# EAGLE design Periscope (EAGLE 7.5.0)
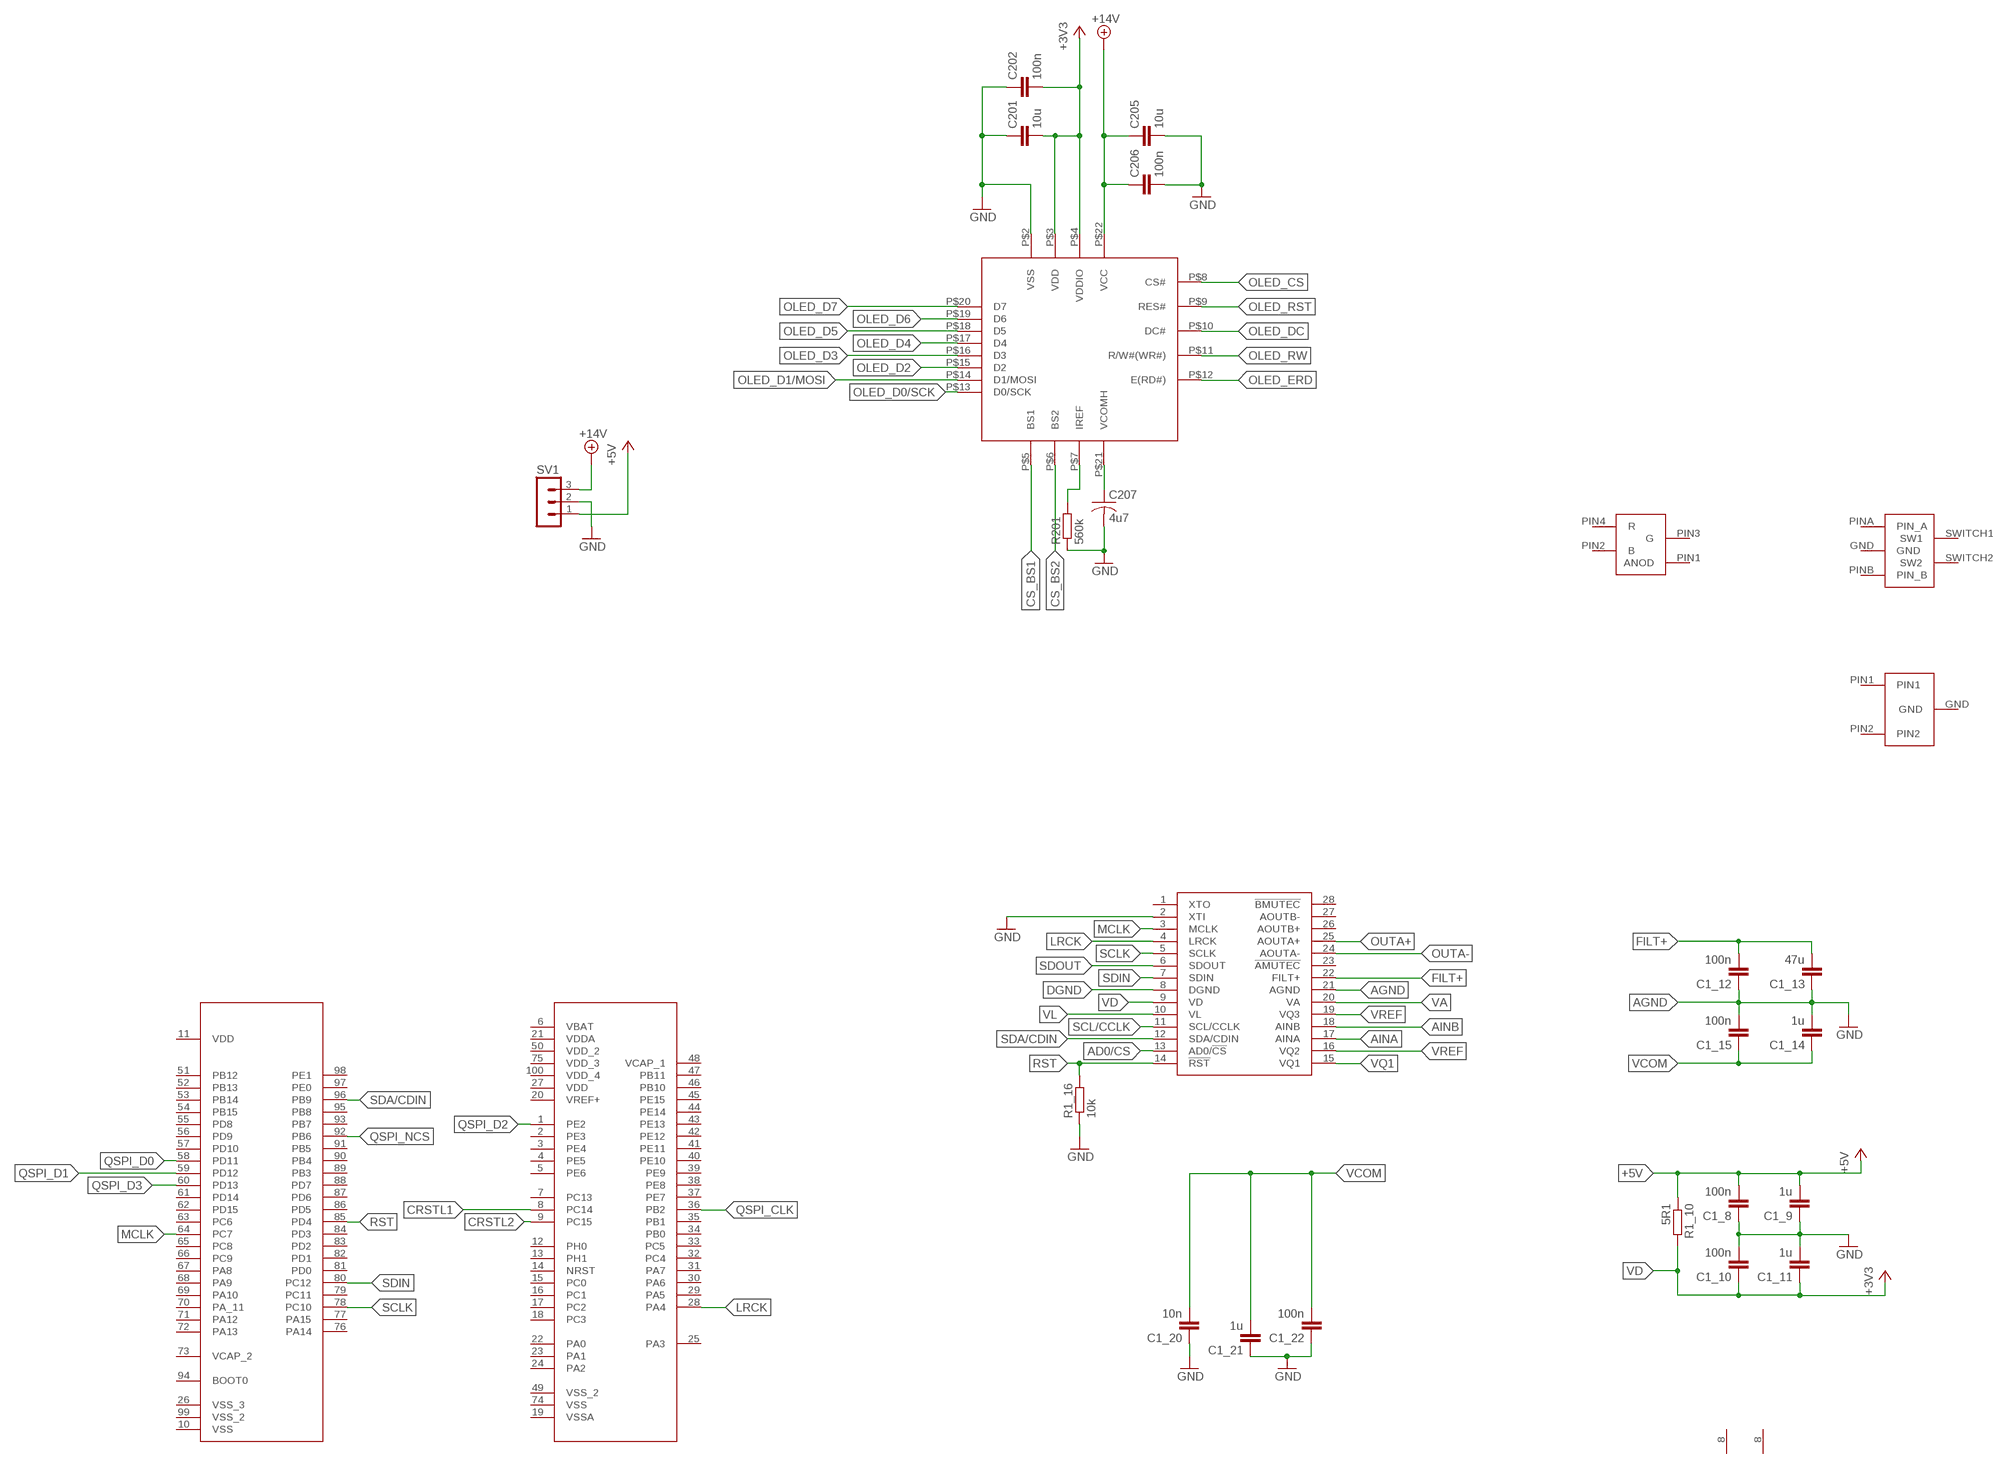
[diagram p0: schematic, sheet 1, part 1 of 3]
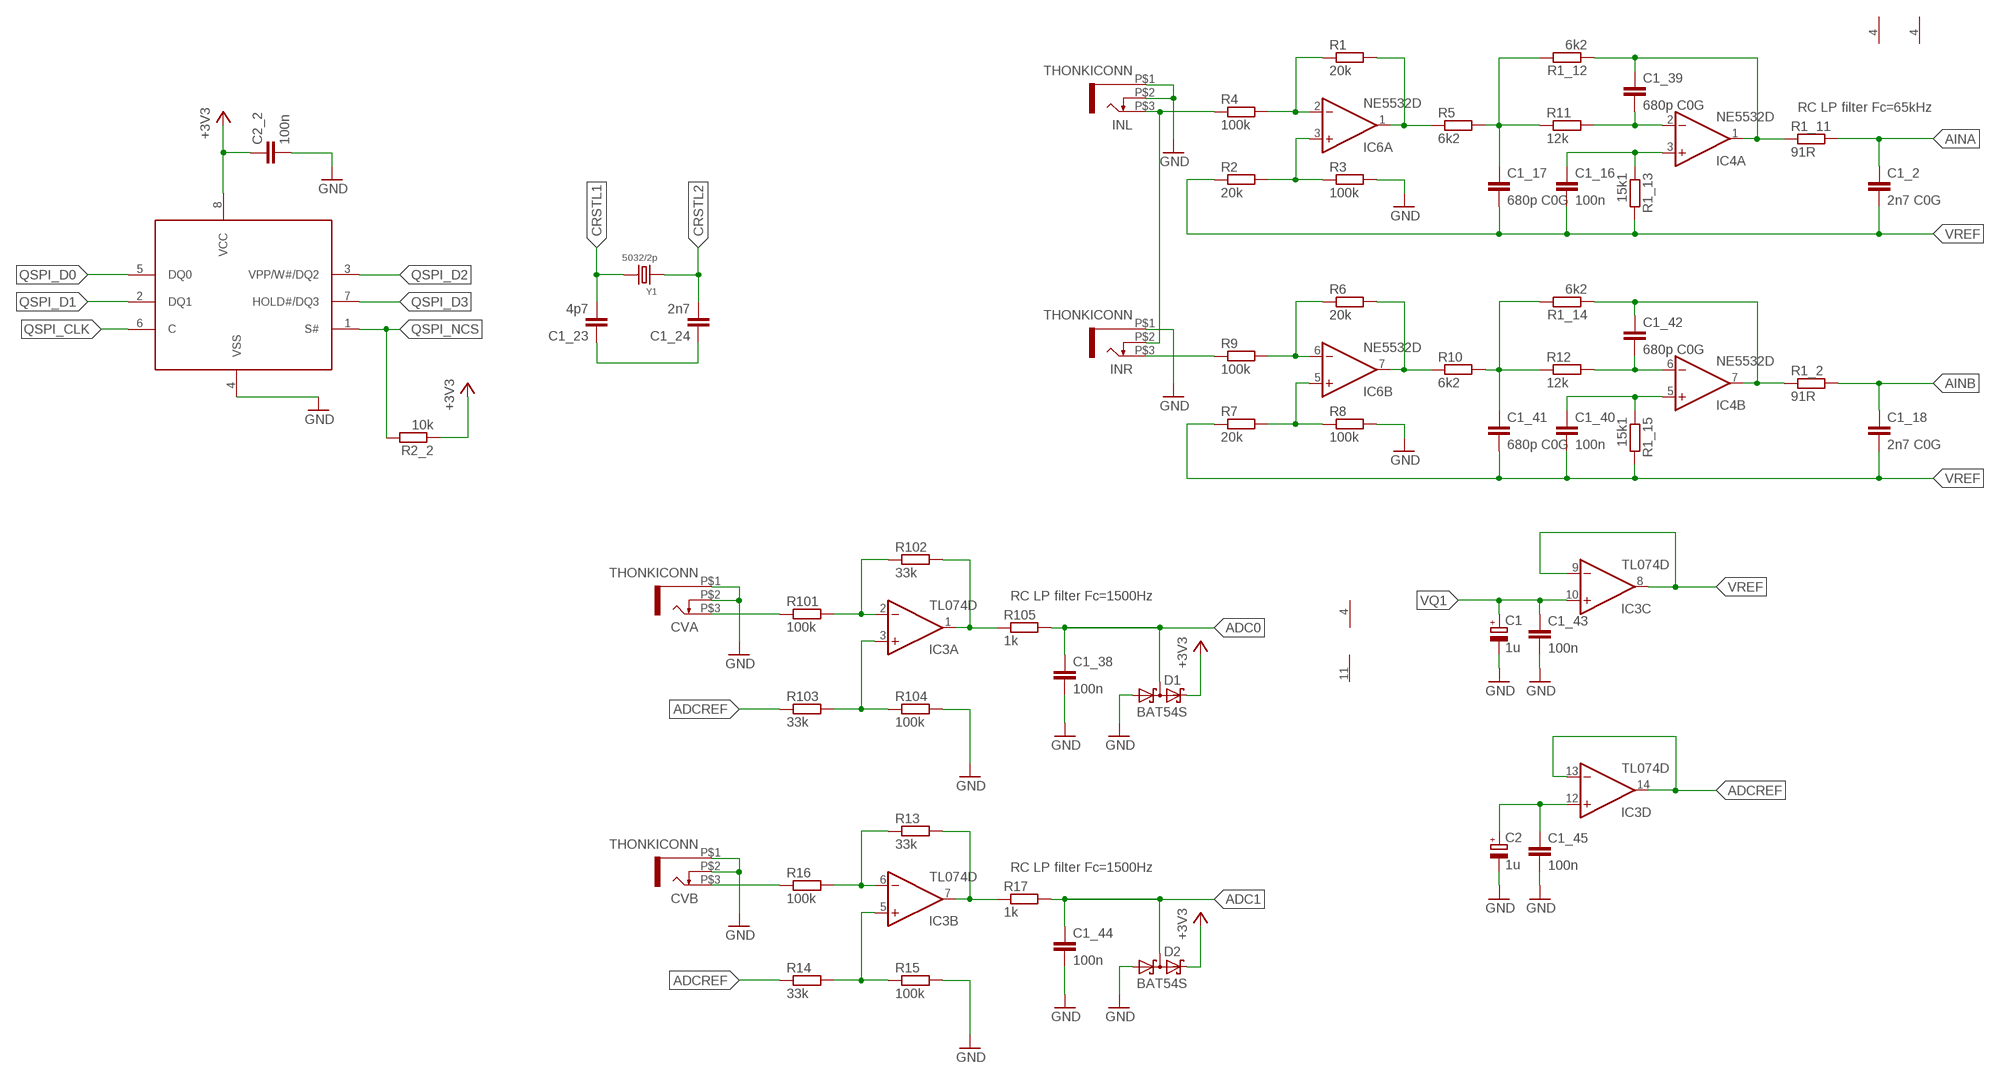
[diagram p1: schematic, sheet 1, part 2 of 3]
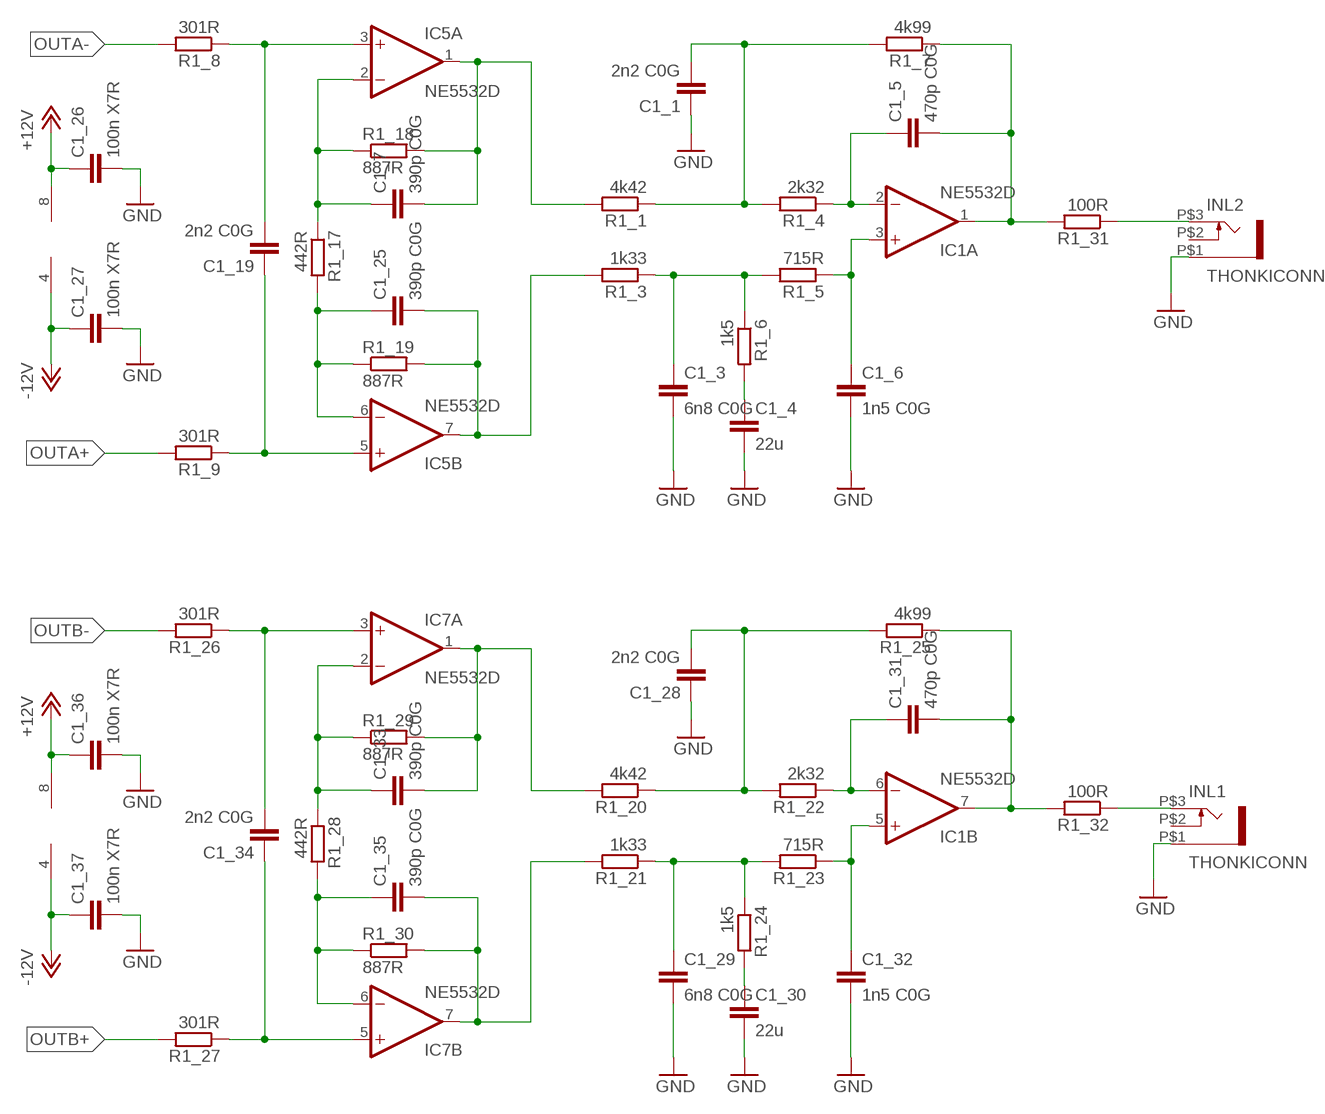
[diagram p2: schematic, sheet 1, part 3 of 3]

## Parts
C1  1u  CPOL-EU153CLV-0505  [153CLV-0505]
C1_1  2n2 C0G  C-EUC0603  [C0603]
C1_2  2n7 C0G  C-EUC0603  [C0603]
C1_3  6n8 C0G  C-EUC0603  [C0603]
C1_4  22u  C-EUC0603  [C0603]
C1_5  470p C0G  C-EUC0603  [C0603]
C1_6  1n5 C0G  C-EUC0603  [C0603]
C1_7  390p C0G  C-EUC0603  [C0603]
C1_8  100n  C-EUC0603  [C0603]
C1_9  1u  C-EUC0603  [C0603]
C1_10  100n  C-EUC0603  [C0603]
C1_11  1u  C-EUC0603  [C0603]
C1_12  100n  C-EUC0603  [C0603]
C1_13  47u  C-EUC0603  [C0603]
C1_14  1u  C-EUC0603  [C0603]
C1_15  100n  C-EUC0603  [C0603]
C1_16  100n  C-EUC0603  [C0603]
C1_17  680p C0G  C-EUC0603  [C0603]
C1_18  2n7 C0G  C-EUC0603  [C0603]
C1_19  2n2 C0G  C-EUC0603  [C0603]
C1_20  10n  C-EUC0603  [C0603]
C1_21  1u  C-EUC0603  [C0603]
C1_22  100n  C-EUC0603  [C0603]
C1_23  4p7  C-EUC0603  [C0603]
C1_24  2n7  C-EUC0603  [C0603]
C1_25  390p C0G  C-EUC0603  [C0603]
C1_26  100n X7R  C-EUC0603  [C0603]
C1_27  100n X7R  C-EUC0603  [C0603]
C1_28  2n2 C0G  C-EUC0603  [C0603]
C1_29  6n8 C0G  C-EUC0603  [C0603]
C1_30  22u  C-EUC0603  [C0603]
C1_31  470p C0G  C-EUC0603  [C0603]
C1_32  1n5 C0G  C-EUC0603  [C0603]
C1_33  390p C0G  C-EUC0603  [C0603]
C1_34  2n2 C0G  C-EUC0603  [C0603]
C1_35  390p C0G  C-EUC0603  [C0603]
C1_36  100n X7R  C-EUC0603  [C0603]
C1_37  100n X7R  C-EUC0603  [C0603]
C1_38  100n  C-EUC0603  [C0603]
C1_39  680p C0G  C-EUC0603  [C0603]
C1_40  100n  C-EUC0603  [C0603]
C1_41  680p C0G  C-EUC0603  [C0603]
C1_42  680p C0G  C-EUC0603  [C0603]
C1_43  100n  C-EUC0603  [C0603]
C1_44  100n  C-EUC0603  [C0603]
C1_45  100n  C-EUC0603  [C0603]
C2  1u  CPOL-EU153CLV-0505  [153CLV-0505]
C2_2  100n  C-EUC0603  [C0603]
C201  10u  C-EUC0603  [C0603]
C202  100n  C-EUC0603  [C0603]
C205  10u  C-EUC0603  [C0603]
C206  100n  C-EUC0603  [C0603]
C207  4u7  C-USC0603  [C0603]
CVA  THONKICONN  [THONKICONN]
CVB  THONKICONN  [THONKICONN]
D1  BAT54S  [SOT23]
D2  BAT54S  [SOT23]
IC1  NE5532D  [SO08]
IC3  TL074D  [SO14]
IC4  NE5532D  [SO08]
IC5  NE5532D  [SO08]
IC6  NE5532D  [SO08]
IC7  NE5532D  [SO08]
INL  THONKICONN  [THONKICONN]
INL1  THONKICONN  [THONKICONN]
INL2  THONKICONN  [THONKICONN]
INR  THONKICONN  [THONKICONN]
R1  20k  R-EU_R0603  [R0603]
R1_1  4k42  R-EU_R0603  [R0603]
R1_2  91R  R-EU_R0603  [R0603]
R1_3  1k33  R-EU_R0603  [R0603]
R1_4  2k32  R-EU_R0603  [R0603]
R1_5  715R  R-EU_R0603  [R0603]
R1_6  1k5  R-EU_R0603  [R0603]
R1_7  4k99  R-EU_R0603  [R0603]
R1_8  301R  R-EU_R0603  [R0603]
R1_9  301R  R-EU_R0603  [R0603]
R1_10  5R1  R-EU_R0603  [R0603]
R1_11  91R  R-EU_R0603  [R0603]
R1_12  6k2  R-EU_R0603  [R0603]
R1_13  15k1  R-EU_R0603  [R0603]
R1_14  6k2  R-EU_R0603  [R0603]
R1_15  15k1  R-EU_R0603  [R0603]
R1_16  10k  R-EU_R0603  [R0603]
R1_17  442R  R-EU_R0603  [R0603]
R1_18  887R  R-EU_R0603  [R0603]
R1_19  887R  R-EU_R0603  [R0603]
R1_20  4k42  R-EU_R0603  [R0603]
R1_21  1k33  R-EU_R0603  [R0603]
R1_22  2k32  R-EU_R0603  [R0603]
R1_23  715R  R-EU_R0603  [R0603]
R1_24  1k5  R-EU_R0603  [R0603]
R1_25  4k99  R-EU_R0603  [R0603]
R1_26  301R  R-EU_R0603  [R0603]
R1_27  301R  R-EU_R0603  [R0603]
R1_28  442R  R-EU_R0603  [R0603]
R1_29  887R  R-EU_R0603  [R0603]
R1_30  887R  R-EU_R0603  [R0603]
R1_31  100R  R-EU_R0603  [R0603]
R1_32  100R  R-EU_R0603  [R0603]
R2  20k  R-EU_R0603  [R0603]
R2_2  10k  R-EU_R0603  [R0603]
R3  100k  R-EU_R0603  [R0603]
R4  100k  R-EU_R0603  [R0603]
R5  6k2  R-EU_R0603  [R0603]
R6  20k  R-EU_R0603  [R0603]
R7  20k  R-EU_R0603  [R0603]
R8  100k  R-EU_R0603  [R0603]
R9  100k  R-EU_R0603  [R0603]
R10  6k2  R-EU_R0603  [R0603]
R11  12k  R-EU_R0603  [R0603]
R12  12k  R-EU_R0603  [R0603]
R13  33k  R-EU_R0603  [R0603]
R14  33k  R-EU_R0603  [R0603]
R15  100k  R-EU_R0603  [R0603]
R16  100k  R-EU_R0603  [R0603]
R17  1k  R-EU_R0603  [R0603]
R101  100k  R-EU_R0603  [R0603]
R102  33k  R-EU_R0603  [R0603]
R103  33k  R-EU_R0603  [R0603]
R104  100k  R-EU_R0603  [R0603]
R105  1k  R-EU_R0603  [R0603]
R201  560k  R-EU_R0603  [R0603]
SV1  MA03-1  [MA03-1]
U$1  PLCC4_RGB_LED  [PLCC4_RGB_LED]
U$2  EC12E2424407  [EC12E2424407]
U$3  MCOT096064AZ-RGBM  [MCOT096064AZ-RGBM]
U$4  CS4271  [TSSOP28-0.65-9.7X4.4MM]
U$5  STM32F746VGT6  [QFP50P1600X1600X160-100N]
U$6  N25Q128A13  [SO8W]
U$8  EC12E2430802  [EC12E2430802]
Y1  5032/2p  SMD-CRYSTAL-8MHZ-20PF-20PPM(2P-5.0X3.2MM)  [X2-SMD-5.0X3.2X1.3MM]

## Nets
+3V3: C2_2.1 C201.2 C202.2 D1.2(C2) D2.2(C2) R2_2.1 U$3.P$3(VDD) U$3.P$4(VDDIO) U$6.8(VCC)
+5V: C1_8.2 C1_9.2 R1_10.1 SV1.1
+12V: C1_26.1 C1_36.1 IC5.8(P:V+) IC7.8(P:V+)
+14V: C205.1 C206.1 SV1.3 U$3.P$22(VCC)
-12V: C1_27.1 C1_37.1 IC5.4(P:V-) IC7.4(P:V-)
AD0/CS: U$4.13(AD0/!CS)
ADC0: C1_38.1 D1.3(C1A2) R105.2
ADC1: C1_44.1 D2.3(C1A2) R17.2
ADCREF: IC3.13(D:-IN) IC3.14(D:OUT) R14.1 R103.1
AGND: C1_12.1 C1_13.1 C1_14.2 C1_15.2 U$4.21(AGND) ; supply symbol labelled GND
AINA: C1_2.1 R1_11.2 U$4.17(AINA)
AINB: C1_18.1 R1_2.2 U$4.18(AINB)
ANALOG_OUTA: C1_5.2 IC1.1(A:OUT) R1_7.1 R1_31.2
ANALOG_OUTB: C1_31.2 IC1.7(B:OUT) R1_25.1 R1_32.2
CRSTL1: C1_23.2 U$5.8(PC14) Y1.2
CRSTL2: C1_24.2 U$5.9(PC15) Y1.1
CS_BS1: U$3.P$5(BS1)
CS_BS2: U$3.P$6(BS2)
DGND: U$4.8(DGND)
FILT+: C1_12.2 C1_13.2 U$4.22(FILT+)
GND: C1.- C1_1.1 C1_3.2 C1_4.2 C1_6.2 C1_8.1 C1_9.1 C1_10.2 C1_11.2 C1_20.1 C1_21.1 C1_22.1 C1_26.2 C1_27.2 C1_28.1 C1_29.2 C1_30.2 C1_32.2 C1_36.2 C1_37.2 C1_38.2 C1_43.2 C1_44.2 C1_45.2 C2.- C2_2.2 C201.1 C202.1 C205.2 C206.2 C207.2 CVA.P$1 CVA.P$2 CVB.P$1 CVB.P$2 D1.1(A1) D2.1(A1) INL1.P$1 INL2.P$1 INL.P$1 INL.P$2 INR.P$1 R1_16.1 R3.2 R8.2 R15.2 R104.2 R201.1 SV1.2 U$3.P$2(VSS) U$4.2(XTI) U$6.4(VSS)
LRCK: U$4.4(LRCK) U$5.28(PA4)
MCLK: U$4.3(MCLK) U$5.64(PC7)
N$1: C1_3.1 R1_3.1 R1_5.2 R1_6.1
N$2: IC3.3(A:+IN) R103.2 R104.1
N$3: C1_23.1 C1_24.1
N$4: IC3.2(A:-IN) R101.2 R102.1
N$5: IC3.1(A:OUT) R102.2 R105.1
N$6: C207.1 U$3.P$21(VCOMH)
N$7: CVA.P$3 R101.1
N$8: R201.2 U$3.P$7(IREF)
N$9: C1_4.1 R1_6.2
N$10: C1_1.2 R1_1.1 R1_4.2 R1_7.2
N$11: C1_7.2 IC5.1(A:OUT) R1_1.2 R1_18.2
N$12: C1_25.2 IC5.7(B:OUT) R1_3.2 R1_19.2
N$13: C1_5.1 IC1.2(A:-IN) R1_4.1
N$14: C1_6.1 IC1.3(A:+IN) R1_5.1
N$15: C1_19.2 IC5.3(A:+IN) R1_8.1
N$16: C1_17.1 R1_12.2 R5.2 R11.1
N$17: C1_7.1 IC5.2(A:-IN) R1_17.1 R1_18.1
N$18: C1_39.2 IC4.2(A:-IN) R11.2
N$19: C1_39.1 IC4.1(A:OUT) R1_11.1 R1_12.1
N$20: C1_19.1 IC5.5(B:+IN) R1_9.1
N$21: C1_16.1 IC4.3(A:+IN) R1_13.1
N$22: C1_25.1 IC5.6(B:-IN) R1_17.2 R1_19.1
N$23: INL2.P$3 R1_31.1
N$24: INL1.P$3 R1_32.1
N$25: C1_29.1 R1_21.1 R1_23.2 R1_24.1
N$26: C1_28.2 R1_20.1 R1_22.2 R1_25.2
N$27: C1_31.1 IC1.6(B:-IN) R1_22.1
N$28: C1_32.1 IC1.5(B:+IN) R1_23.1
N$29: C1_30.1 R1_24.2
N$30: C1_33.2 IC7.1(A:OUT) R1_20.2 R1_29.2
N$31: C1_35.2 IC7.7(B:OUT) R1_21.2 R1_30.2
N$32: C1_34.2 IC7.3(A:+IN) R1_26.1
N$33: C1_33.1 IC7.2(A:-IN) R1_28.1 R1_29.1
N$34: C1_34.1 IC7.5(B:+IN) R1_27.1
N$35: C1_35.1 IC7.6(B:-IN) R1_28.2 R1_30.1
N$36: IC6.3(A:+IN) R2.2 R3.1
N$37: C1_42.1 IC4.7(B:OUT) R1_2.1 R1_14.1
N$38: IC6.2(A:-IN) R1.1 R4.2
N$39: INL.P$3 INR.P$2 R4.1
N$40: IC6.1(A:OUT) R1.2 R5.1
N$41: C1_41.1 R1_14.2 R10.2 R12.1
N$42: IC6.5(B:+IN) R7.2 R8.1
N$43: IC6.6(B:-IN) R6.1 R9.2
N$44: INR.P$3 R9.1
N$45: IC6.7(B:OUT) R6.2 R10.1
N$46: C1_42.2 IC4.6(B:-IN) R12.2
N$47: C1_40.1 IC4.5(B:+IN) R1_15.1
N$48: C1_45.1 C2.+ IC3.12(D:+IN)
N$49: IC3.5(B:+IN) R14.2 R15.1
N$50: IC3.6(B:-IN) R13.1 R16.2
N$51: CVB.P$3 R16.1
N$52: IC3.7(B:OUT) R13.2 R17.1
OLED_CS: U$3.P$8(CS#)
OLED_D0/SCK: U$3.P$13(D0/SCK)
OLED_D1/MOSI: U$3.P$14(D1/MOSI)
OLED_D2: U$3.P$15(D2)
OLED_D3: U$3.P$16(D3)
OLED_D4: U$3.P$17(D4)
OLED_D5: U$3.P$18(D5)
OLED_D6: U$3.P$19(D6)
OLED_D7: U$3.P$20(D7)
OLED_DC: U$3.P$10(DC#)
OLED_ERD: U$3.P$12(E(RD#))
OLED_RST: U$3.P$9(RES#)
OLED_RW: U$3.P$11(R/W#(WR#))
OUTA+: R1_9.2 U$4.25(AOUTA+)
OUTA-: R1_8.2 U$4.24(AOUTA-)
OUTB+: R1_27.2
OUTB-: R1_26.2
QSPI_CLK: U$5.36(PB2) U$6.6(C)
QSPI_D0: U$5.58(PD11) U$6.5(DQ0)
QSPI_D1: U$5.59(PD12) U$6.2(DQ1)
QSPI_D2: U$5.1(PE2) U$6.3(VPP/W#/DQ2)
QSPI_D3: U$5.60(PD13) U$6.7(HOLD#/DQ3)
QSPI_NCS: R2_2.2 U$5.92(PB6) U$6.1(S#)
RST: R1_16.2 U$4.14(!RST) U$5.85(PD4)
SCL/CCLK: U$4.11(SCL/CCLK)
SCLK: U$4.5(SCLK) U$5.78(PC10)
SDA/CDIN: U$4.12(SDA/CDIN) U$5.96(PB9)
SDIN: U$4.7(SDIN) U$5.80(PC12)
SDOUT: U$4.6(SDOUT)
VA: U$4.20(VA)
VCOM: C1_14.1 C1_15.1 C1_20.2 C1_21.2 C1_22.2
VD: C1_10.1 C1_11.1 R1_10.2 U$4.9(VD) ; supply symbol labelled +3V3
VL: U$4.10(VL)
VQ1: C1.+ C1_43.1 IC3.10(C:+IN) U$4.15(VQ1)
VREF: C1_2.2 C1_16.2 C1_17.2 C1_18.2 C1_40.2 C1_41.2 IC3.8(C:OUT) IC3.9(C:-IN) R1_13.2 R1_15.2 R2.1 R7.1 U$4.16(VQ2) U$4.19(VQ3)
Unconnected: INL1.P$2 INL2.P$2 U$1.PIN1(ANOD) U$1.PIN2(B) U$1.PIN3(G) U$1.PIN4(R) U$2.GND U$2.PINA(PIN_A) U$2.PINB(PIN_B) U$2.SWITCH1(SW1) U$2.SWITCH2(SW2) U$4.1(XTO) U$4.23(!AMUTEC) U$4.26(AOUTB+) U$4.27(AOUTB-) U$4.28(!BMUTEC) U$5.2(PE3) U$5.3(PE4) U$5.4(PE5) U$5.5(PE6) U$5.6(VBAT) U$5.7(PC13) U$5.10(VSS) U$5.11(VDD) U$5.12(PH0) U$5.13(PH1) U$5.14(NRST) U$5.15(PC0) U$5.16(PC1) U$5.17(PC2) U$5.18(PC3) U$5.19(VSSA) U$5.20(VREF+) U$5.21(VDDA) U$5.22(PA0) U$5.23(PA1) U$5.24(PA2) U$5.25(PA3) U$5.26(VSS_3) U$5.27(VDD) U$5.29(PA5) U$5.30(PA6) U$5.31(PA7) U$5.32(PC4) U$5.33(PC5) U$5.34(PB0) U$5.35(PB1) U$5.37(PE7) U$5.38(PE8) U$5.39(PE9) U$5.40(PE10) U$5.41(PE11) U$5.42(PE12) U$5.43(PE13) U$5.44(PE14) U$5.45(PE15) U$5.46(PB10) U$5.47(PB11) U$5.48(VCAP_1) U$5.49(VSS_2) U$5.50(VDD_2) U$5.51(PB12) U$5.52(PB13) U$5.53(PB14) U$5.54(PB15) U$5.55(PD8) U$5.56(PD9) U$5.57(PD10) U$5.61(PD14) U$5.62(PD15) U$5.63(PC6) U$5.65(PC8) U$5.66(PC9) U$5.67(PA8) U$5.68(PA9) U$5.69(PA10) U$5.70(PA_11) U$5.71(PA12) U$5.72(PA13) U$5.73(VCAP_2) U$5.74(VSS) U$5.75(VDD_3) U$5.76(PA14) U$5.77(PA15) U$5.79(PC11) U$5.81(PD0) U$5.82(PD1) U$5.83(PD2) U$5.84(PD3) U$5.86(PD5) U$5.87(PD6) U$5.88(PD7) U$5.89(PB3) U$5.90(PB4) U$5.91(PB5) U$5.93(PB7) U$5.94(BOOT0) U$5.95(PB8) U$5.97(PE0) U$5.98(PE1) U$5.99(VSS_2) U$5.100(VDD_4) U$8.GND U$8.PIN1 U$8.PIN2

## Notes on the sheet
- RC LP filter Fc=65kHz
- RC LP filter Fc=1500Hz
- RC LP filter Fc=1500Hz

## Power pins joined to a net without a drawn wire
V+: IC1.8(P:V+) IC3.4(P:V+) IC4.8(P:V+) IC6.8(P:V+)
V-: IC1.4(P:V-) IC3.11(P:V-) IC4.4(P:V-) IC6.4(P:V-)

## Library data of the parts
C1 C2 = resistor:CPOL-EU: POLARIZED CAPACITOR, European symbol
C1_1-C1_45 C2_2 C201 C202 C205 C206 = rcl:C-EU: CAPACITOR, European symbol
C207 = rcl:C-US: CAPACITOR, American symbol
CVA CVB INL INL1 INL2 INR = Rebel:THONKICONN
D1 D2 = diode:BAT54S: Schottky Diodes Pin connection corrected 2011-05-04 Source: Fairchild .. BAT54.pdf
IC1 IC4-IC7 = linear:NE5532: AUDIO AMPLIFIER
IC3 = linear:TL074: OP AMP
R1 R1_1-R1_32 R2 R2_2 R3-R17 R101-R105 R201 = rcl:R-EU_: RESISTOR, European symbol
SV1 = con-lstb:MA03-1: PIN HEADER; OC_FARNELL: unknown; OC_NEWARK: unknown
U$1 = Rebel:PLCC4_RGB_LED: PLCC4_RGB_LED
U$2 = Rebel:EC12E2424407: rotary encoder with switch EC12E2424407
U$3 = MCOT096064AZ-RGBM:MCOT096064AZ-RGBM: Midas 0.95in Red, Green, Blue Passive matrix OLED Display 96 x 64 TAB Multi Interface
U$4 = Rebel:CS4271
U$5 = Rebel_copy:STM32F746VGT6: STM32F746VGT6
U$6 = Rebel_copy:N25Q128A13: N25Q128A13 Flash Memory SO8W
U$8 = Rebel:EC12E2430802: EC12E2430802 rotary encoder without a switch
Y1 = Seeed-OPL-crystal-osctllator:SMD-CRYSTAL-8MHZ-20PF-20PPM(2P-5.0X3.2MM): 306010004; MPN: 5032/2P

## Board
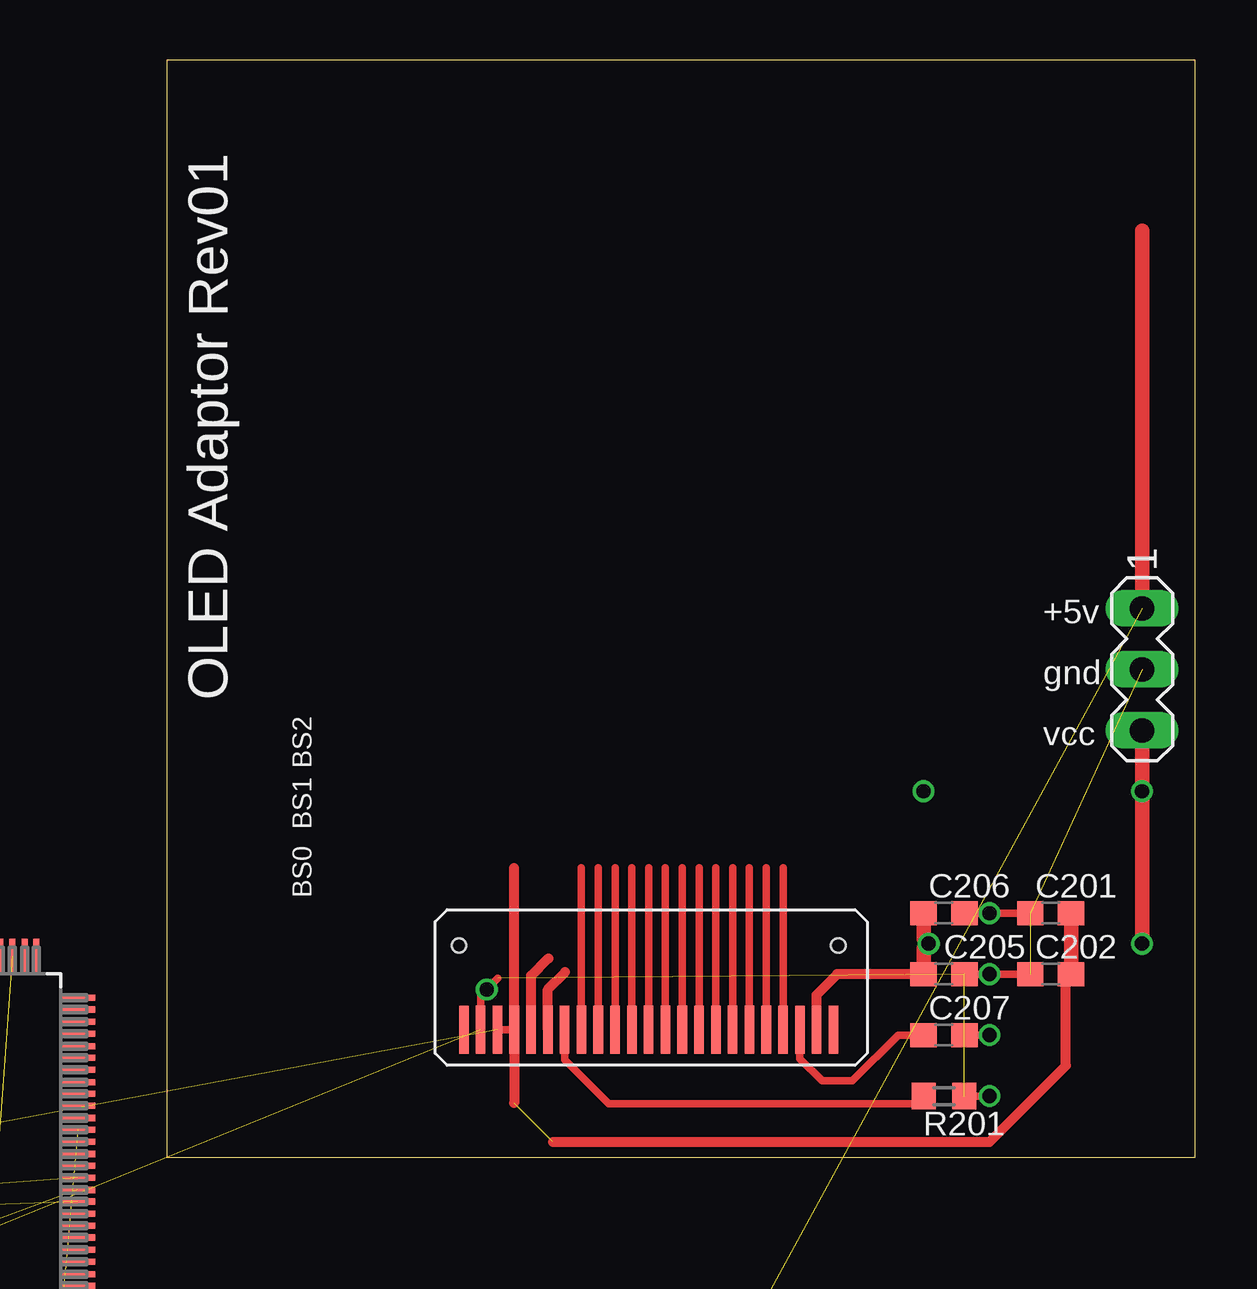
[diagram p3: board, top side]
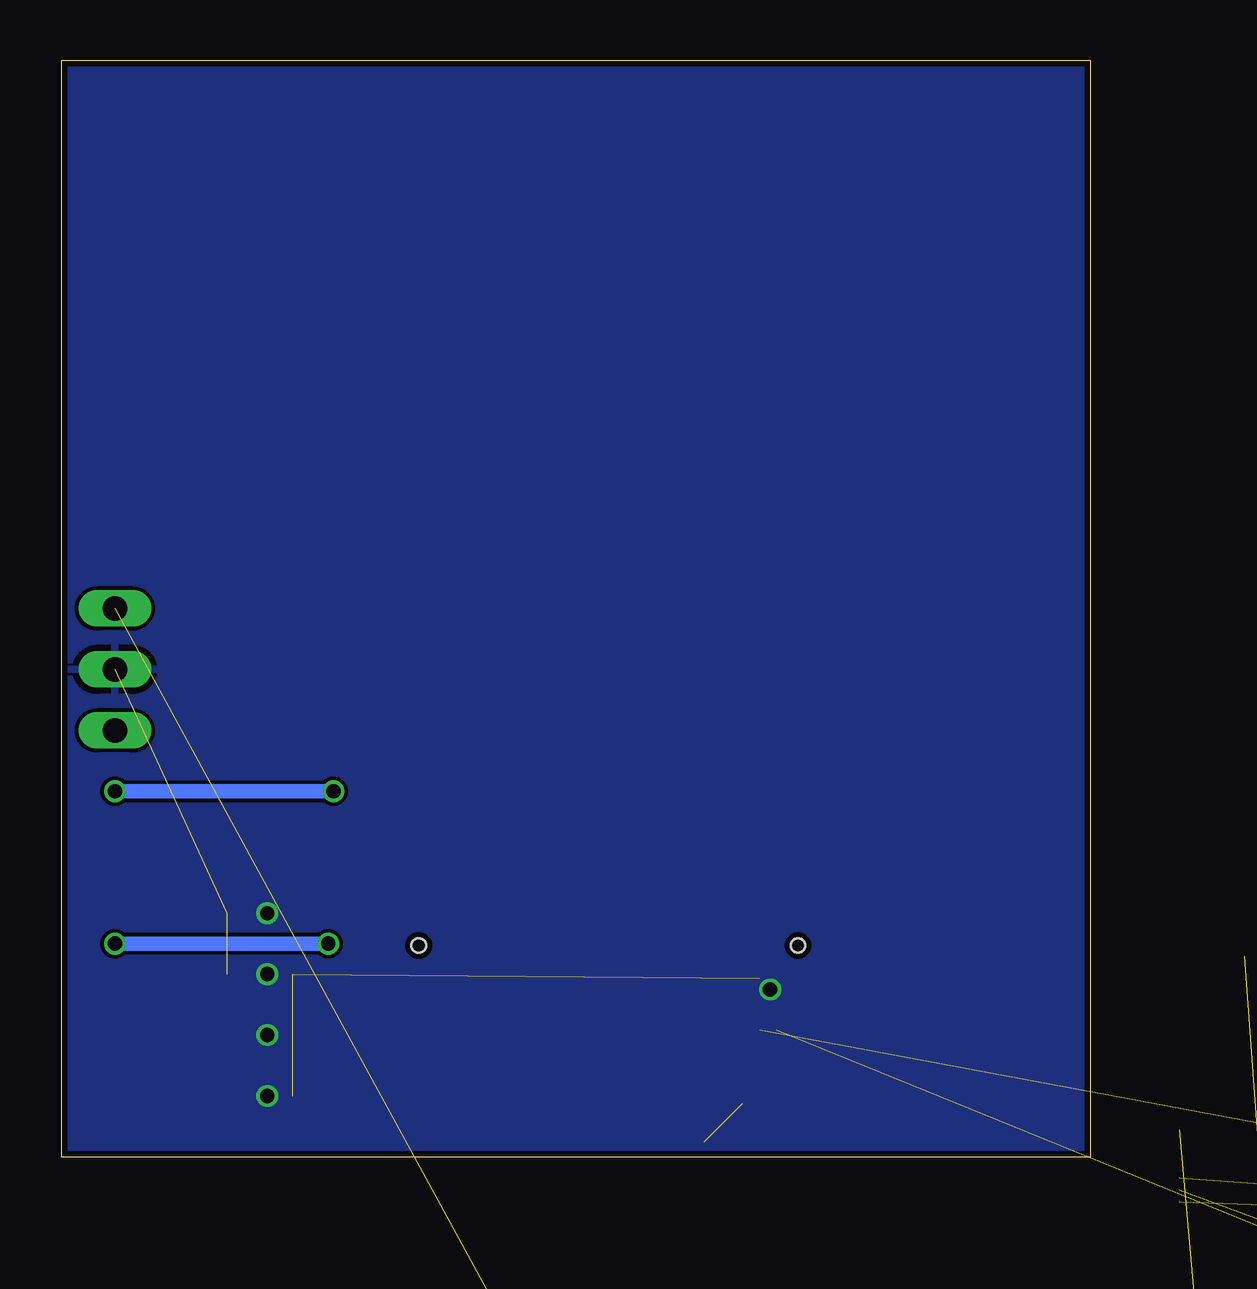
[diagram p4: board, bottom side, seen from below]

Size 42.85 x 45.71 mm. Coordinates in mm from the lower left corner, seen from the top.
Outline: 0,0 42.85,0 42.85,45.71 0,45.71 0,0
Copper layers (1*16): Top 0.035mm / dielectric 1.5mm / Bottom 0.035mm
Design rules "SeeedStudio_2layer_DRU_no_angle_20140221": minimum track width 6mil, minimum drill 12mil, track to track 6mil, track to pad 6mil, pad to pad 6mil, via to via 6mil, smd to smd 0mil, copper to edge 10mil, drill to drill 10mil, minimum pad ring 10mil, minimum via ring 6mil, stop-mask expansion 2mil, vias tented up to drill 100mil, thermal gap 10mil

### Footprints (pad centres in the part's own frame; a part is rotated, then mirrored left to right if it is on the bottom)
153CLV-0505 = smd 3 x 1.6: + 2.2,0; - -2.2,0
C0603 = smd 1.1 x 1: 1 -0.85,0; 2 0.85,0
THONKICONN = drill 1: P$1 0,-5.5; P$2 0,-3.38; P$3 0,4.92 | hole 3.6: 0,0
SOT23 = smd 1 x 1.4: 1 -0.95,-1.1; 2 0.95,-1.1; 3 0,1.1
SO08 = smd 0.6 x 2.2: 1 -1.905,-2.6; 2 -0.635,-2.6; 3 0.635,-2.6; 4 1.905,-2.6; 5 1.905,2.6; 6 0.635,2.6; 7 -0.635,2.6; 8 -1.905,2.6
SO14 = smd 0.6 x 2.2: 1 -3.81,-2.6; 2 -2.54,-2.6; 3 -1.27,-2.6; 4 0,-2.6; 5 1.27,-2.6; 6 2.54,-2.6; 7 3.81,-2.6; 8 3.81,2.6; 9 2.54,2.6; 10 1.27,2.6; 11 0,2.6; 12 -1.27,2.6; 13 -2.54,2.6; 14 -3.81,2.6
R0603 = smd 1 x 1.1: 1 -0.85,0; 2 0.85,0
MA03-1 = drill 1.016 long: 1 -2.54,0; 2 0,0; 3 2.54,0
PLCC4_RGB_LED = smd 1.1 x 1.5: PIN1 -0.75,-1.5; PIN2 -0.75,1.5; PIN3 0.75,1.5; PIN4 0.75,-1.5
EC12E2424407 = drill 1: GND 0,-7.5; PINA -2.5,-7.5; PINB 2.5,-7.5; SWITCH1 -2.5,7; SWITCH2 2.5,7 | drill 2.1: P$1 -5.6,0; P$2 5.6,0
MCOT096064AZ-RGBM = smd 0.4 x 2: P$1 -7.72,-2.024; P$2 -7.02,-2.024; P$3 -6.32,-2.024; P$4 -5.62,-2.024; P$5 -4.92,-2.024; P$6 -4.22,-2.024; P$7 -3.52,-2.024; P$8 -2.82,-2.024; P$9 -2.12,-2.024; P$10 -1.42,-2.024; P$11 -0.72,-2.024; P$12 -0.02,-2.024; P$13 0.68,-2.024; P$14 1.38,-2.024; P$15 2.08,-2.024; P$16 2.78,-2.024; P$17 3.48,-2.024; P$18 4.18,-2.024; P$19 4.88,-2.024; P$20 5.58,-2.024; P$21 6.28,-2.024; P$22 6.98,-2.024; P$23 7.68,-2.024 | hole 0.6: -7.92,1.476; 7.88,1.476
TSSOP28-0.65-9.7X4.4MM = smd 0.4 x 1.15: 1 -4.225,-3.1; 2 -3.575,-3.1; 3 -2.925,-3.1; 4 -2.275,-3.1; 5 -1.625,-3.1; 6 -0.975,-3.1; 7 -0.325,-3.1; 8 0.325,-3.1; 9 0.975,-3.1; 10 1.625,-3.1; 11 2.275,-3.1; 12 2.925,-3.1; 13 3.575,-3.1; 14 4.225,-3.1; 15 4.225,3.1; 16 3.575,3.1; 17 2.925,3.1; 18 2.275,3.1; 19 1.625,3.1; 20 0.975,3.1; 21 0.325,3.1; 22 -0.325,3.1; 23 -0.975,3.1; 24 -1.625,3.1; 25 -2.275,3.1; 26 -2.925,3.1; 27 -3.575,3.1; 28 -4.225,3.1
QFP50P1600X1600X160-100N = smd 1.473 x 0.254: 1 -7.722,5.994; 2 -7.722,5.512; 3 -7.722,5.004; 4 -7.722,4.496; 5 -7.722,3.988; 6 -7.722,3.505; 7 -7.722,2.997; 8 -7.722,2.489; 9 -7.722,2.007; 10 -7.722,1.499; 11 -7.722,0.991; 12 -7.722,0.508; 13 -7.722,0; 14 -7.722,-0.508; 15 -7.722,-0.991; 16 -7.722,-1.499; 17 -7.722,-2.007; 18 -7.722,-2.489; 19 -7.722,-2.997; 20 -7.722,-3.505; 21 -7.722,-3.988; 22 -7.722,-4.496; 23 -7.722,-5.004; 24 -7.722,-5.512; 25 -7.722,-5.994; 51 7.722,-5.994; 52 7.722,-5.512; 53 7.722,-5.004; 54 7.722,-4.496; 55 7.722,-3.988; 56 7.722,-3.505; 57 7.722,-2.997; 58 7.722,-2.489; 59 7.722,-2.007; 60 7.722,-1.499; 61 7.722,-0.991; 62 7.722,-0.508; 63 7.722,0; 64 7.722,0.508; 65 7.722,0.991; 66 7.722,1.499; 67 7.722,2.007; 68 7.722,2.489; 69 7.722,2.997; 70 7.722,3.505; 71 7.722,3.988; 72 7.722,4.496; 73 7.722,5.004; 74 7.722,5.512; 75 7.722,5.994 | smd 0.254 x 1.473: 26 -5.994,-7.722; 27 -5.512,-7.722; 28 -5.004,-7.722; 29 -4.496,-7.722; 30 -3.988,-7.722; 31 -3.505,-7.722; 32 -2.997,-7.722; 33 -2.489,-7.722; 34 -2.007,-7.722; 35 -1.499,-7.722; 36 -0.991,-7.722; 37 -0.508,-7.722; 38 0,-7.722; 39 0.508,-7.722; 40 0.991,-7.722; 41 1.499,-7.722; 42 2.007,-7.722; 43 2.489,-7.722; 44 2.997,-7.722; 45 3.505,-7.722; 46 3.988,-7.722; 47 4.496,-7.722; 48 5.004,-7.722; 49 5.512,-7.722; 50 5.994,-7.722; 76 5.994,7.722; 77 5.512,7.722; 78 5.004,7.722; 79 4.496,7.722; 80 3.988,7.722; 81 3.505,7.722; 82 2.997,7.722; 83 2.489,7.722; 84 2.007,7.722; 85 1.499,7.722; 86 0.991,7.722; 87 0.508,7.722; 88 0,7.722; 89 -0.508,7.722; 90 -0.991,7.722; 91 -1.499,7.722; 92 -2.007,7.722; 93 -2.489,7.722; 94 -2.997,7.722; 95 -3.505,7.722; 96 -3.988,7.722; 97 -4.496,7.722; 98 -5.004,7.722; 99 -5.512,7.722; 100 -5.994,7.722
SO8W = smd 0.6 x 2.2: 1 -1.905,-3.75; 2 -0.635,-3.75; 3 0.635,-3.75; 4 1.905,-3.75; 5 1.905,3.75; 6 0.635,3.75; 7 -0.635,3.75; 8 -1.905,3.75
EC12E2430802 = drill 1: GND 0,-7.5; PIN1 -2.5,-7.5; PIN2 2.5,-7.5 | drill 2.1: P$1 -5.6,0; P$2 5.6,0
X2-SMD-5.0X3.2X1.3MM = smd 1.778 x 2.032: 1 -2.159,0; 2 2.159,0

### Placement (x,y rotation side)
C1  -198.12,-565.78 0 top  (outside the outline)
C1_1  -29.84,-44.45 0 top  (outside the outline)
C1_2  -29.84,-155.58 0 top  (outside the outline)
C1_3  -29.84,-49.53 0 top  (outside the outline)
C1_4  -29.84,-64.77 0 top  (outside the outline)
C1_5  -29.84,-79.38 0 top  (outside the outline)
C1_6  -29.84,-84.45 0 top  (outside the outline)
C1_7  -93.34,-368.3 0 top  (outside the outline)
C1_8  -29.84,-104.77 0 top  (outside the outline)
C1_9  -29.84,-109.85 0 top  (outside the outline)
C1_10  -29.84,-114.93 0 top  (outside the outline)
C1_11  -29.84,-120.02 0 top  (outside the outline)
C1_12  -29.84,-125.09 0 top  (outside the outline)
C1_13  -29.84,-130.18 0 top  (outside the outline)
C1_14  -29.84,-135.25 0 top  (outside the outline)
C1_15  -29.84,-140.34 0 top  (outside the outline)
C1_16  -29.84,-200.03 0 top  (outside the outline)
C1_17  -29.84,-205.11 0 top  (outside the outline)
C1_18  -29.84,-286.38 0 top  (outside the outline)
C1_19  -93.34,-378.46 0 top  (outside the outline)
C1_20  -29.84,-230.5 0 top  (outside the outline)
C1_21  -29.84,-235.59 0 top  (outside the outline)
C1_22  -29.84,-240.67 0 top  (outside the outline)
C1_23  -29.84,-266.7 0 top  (outside the outline)
C1_24  -29.84,-271.78 0 top  (outside the outline)
C1_25  -93.34,-383.54 0 top  (outside the outline)
C1_26  -93.34,-393.7 0 top  (outside the outline)
C1_27  -93.34,-398.78 0 top  (outside the outline)
C1_28  -73.03,-414.66 0 top  (outside the outline)
C1_29  -93.34,-419.74 0 top  (outside the outline)
C1_30  -93.34,-424.81 0 top  (outside the outline)
C1_31  -75.56,-403.86 0 top  (outside the outline)
C1_32  -84.45,-419.74 0 top  (outside the outline)
C1_33  -93.34,-414.66 0 top  (outside the outline)
C1_34  -75.56,-419.74 0 top  (outside the outline)
C1_35  -83.19,-414.66 0 top  (outside the outline)
C1_36  -86.36,-424.81 0 top  (outside the outline)
C1_37  -79.38,-424.81 0 top  (outside the outline)
C1_38  -191.13,-522.61 0 top  (outside the outline)
C1_39  -191.13,-532.76 0 top  (outside the outline)
C1_40  -191.13,-548 0 top  (outside the outline)
C1_41  -191.13,-558.16 0 top  (outside the outline)
C1_42  -191.13,-563.25 0 top  (outside the outline)
C1_43  -191.13,-568.33 0 top  (outside the outline)
C1_44  -200.03,-595.63 0 top  (outside the outline)
C1_45  -208.91,-605.79 0 top  (outside the outline)
C2  -207.01,-598.17 0 top  (outside the outline)
C2_2  -29.84,-13.97 0 top  (outside the outline)
C201  36.83,10.16 0 top
C202  36.83,7.62 0 top
C205  32.38,7.62 0 top
C206  32.38,10.16 0 top
C207  32.38,5.08 0 top
CVA  -72.39,-330.84 0 top  (outside the outline)
CVB  -196.85,-577.22 0 top  (outside the outline)
D1  -74.3,-341.63 0 top  (outside the outline)
D2  -186.69,-587.38 0 top  (outside the outline)
IC1  -81.92,-346.07 0 top  (outside the outline)
IC3  -51.44,-334.01 0 top  (outside the outline)
IC4  -36.2,-304.17 0 top  (outside the outline)
IC5  -90.81,-346.07 0 top  (outside the outline)
IC6  -188.59,-515.62 0 top  (outside the outline)
IC7  -81.92,-408.31 0 top  (outside the outline)
INL  -179.07,-459.11 0 top  (outside the outline)
INL1  -119.38,-435.61 0 top  (outside the outline)
INL2  -128.91,-445.77 0 top  (outside the outline)
INR  -179.07,-494.03 0 top  (outside the outline)
R1  -182.25,-485.14 0 top  (outside the outline)
R1_1  -29.84,-24.13 0 top  (outside the outline)
R1_2  -29.84,-179.71 0 top  (outside the outline)
R1_3  -29.84,-29.21 0 top  (outside the outline)
R1_4  -29.84,-34.29 0 top  (outside the outline)
R1_5  -29.84,-39.37 0 top  (outside the outline)
R1_6  -29.84,-54.61 0 top  (outside the outline)
R1_7  -29.84,-59.69 0 top  (outside the outline)
R1_8  -93.34,-353.06 0 top  (outside the outline)
R1_9  -93.34,-358.14 0 top  (outside the outline)
R1_10  -29.84,-145.42 0 top  (outside the outline)
R1_11  -29.84,-184.78 0 top  (outside the outline)
R1_12  -29.84,-189.87 0 top  (outside the outline)
R1_13  -29.84,-194.95 0 top  (outside the outline)
R1_14  -191.13,-542.92 0 top  (outside the outline)
R1_15  -191.13,-553.09 0 top  (outside the outline)
R1_16  -29.84,-255.27 0 top  (outside the outline)
R1_17  -93.34,-363.22 0 top  (outside the outline)
R1_18  -93.34,-373.38 0 top  (outside the outline)
R1_19  -93.34,-388.62 0 top  (outside the outline)
R1_20  -72.39,-424.81 0 top  (outside the outline)
R1_21  -93.34,-429.89 0 top  (outside the outline)
R1_22  -86.36,-429.89 0 top  (outside the outline)
R1_23  -79.38,-429.89 0 top  (outside the outline)
R1_24  -72.39,-429.89 0 top  (outside the outline)
R1_25  -93.34,-434.98 0 top  (outside the outline)
R1_26  -86.36,-434.98 0 top  (outside the outline)
R1_27  -79.38,-434.98 0 top  (outside the outline)
R1_28  -72.39,-434.98 0 top  (outside the outline)
R1_29  -93.34,-440.06 0 top  (outside the outline)
R1_30  -86.36,-440.06 0 top  (outside the outline)
R1_31  -121.92,-445.13 0 top  (outside the outline)
R1_32  -121.92,-450.22 0 top  (outside the outline)
R2  -177.8,-485.14 0 top  (outside the outline)
R2_2  -29.84,-19.05 0 top  (outside the outline)
R3  -174.62,-477.52 0 top  (outside the outline)
R4  -168.91,-477.52 0 top  (outside the outline)
R5  -173.35,-485.14 0 top  (outside the outline)
R6  -171.45,-512.45 0 top  (outside the outline)
R7  -182.25,-517.52 0 top  (outside the outline)
R8  -169.54,-502.92 0 top  (outside the outline)
R9  -182.25,-512.45 0 top  (outside the outline)
R10  -176.53,-512.45 0 top  (outside the outline)
R11  -191.13,-527.69 0 top  (outside the outline)
R12  -191.13,-537.85 0 top  (outside the outline)
R13  -200.03,-600.71 0 top  (outside the outline)
R14  -194.94,-600.71 0 top  (outside the outline)
R15  -193.04,-595.63 0 top  (outside the outline)
R16  -187.32,-595.63 0 top  (outside the outline)
R17  -189.87,-600.71 0 top  (outside the outline)
R101  -56.52,-325.75 0 top  (outside the outline)
R102  -56.52,-310.51 0 top  (outside the outline)
R103  -56.52,-315.6 0 top  (outside the outline)
R104  -56.52,-320.68 0 top  (outside the outline)
R105  -74.93,-347.98 0 top  (outside the outline)
R201  32.38,2.54 180 top
SV1  40.64,20.32 270 top
U$1  -135.25,-450.22 0 top  (outside the outline)
U$2  -144.78,-443.23 0 top  (outside the outline)
U$3  20.1,7.33 0 top
U$4  -26.04,-280.04 0 top  (outside the outline)
U$5  -11.43,0.64 0 top  (outside the outline)
U$6  -26.67,-6.35 0 top  (outside the outline)
U$8  -176.53,-443.23 0 top  (outside the outline)
Y1  -27.3,-260.99 0 top  (outside the outline)

### Tracks (layer width: path | path; a pad name or v marks a point on that pad's centre or on a via)
+3V3  (6 unrouted)
  Top 0.305: 37.47,7.4 C202.2 | U$3.P$3 U$3.P$4
  Top 0.406: 14.48,12.05 U$3.P$4 14.48,2.25 | 16.09,0.64 34.29,0.64 37.47,3.81 37.47,7.4
  Top 0.61: C202.2 C201.2
+5V  (3 unrouted)
  Top 0.61: SV1.1 40.64,38.59
+12V  (3 unrouted)
+14V  (via drill 0.6)
  Top 0.406: C205.1 27.94,7.62 27.08,6.76 U$3.P$22
  Top 0.61: SV1.3 v40.64,15.24 v40.64,8.89 | C206.1 31.54,9.11 v31.75,8.89 31.54,8.67 C205.1
  Bottom 0.61: v40.64,15.24 v31.54,15.24 | v31.75,8.89 v40.64,8.89
-12V  (3 unrouted)
ADC0  (2 unrouted)
ADC1  (2 unrouted)
ADCREF  (3 unrouted)
AGND  (4 unrouted)
AINA  (2 unrouted)
AINB  (2 unrouted)
ANALOG_OUTA  (3 unrouted)
ANALOG_OUTB  (3 unrouted)
CRSTL1  (2 unrouted)
CRSTL2  (2 unrouted)
CS_BS1
  Top 0.406: U$3.P$5 15.18,7.56 15.9,8.28
CS_BS2
  Top 0.406: U$3.P$6 15.88,6.99 16.6,7.71
FILT+  (2 unrouted)
GND  (via drill 0.6)  (49 unrouted)
  Top 0.305: U$3.P$2 13.08,6.73 v13.34,6.98 13.8,7.45 | R201.1 v34.29,2.54 | C206.2 v34.29,10.16 C201.1 | C205.2 v34.29,7.62 C202.1 | C207.2 v34.29,5.08
  pour Bottom: -1.91,48.26 48.26,48.26 48.26,-1.27 -1.91,-1.27
LRCK  (1 unrouted)
MCLK  (1 unrouted)
N$1  (3 unrouted)
N$2  (2 unrouted)
N$3  (1 unrouted)
N$4  (2 unrouted)
N$5  (2 unrouted)
N$6
  Top 0.305: C207.1 30.48,5.08 28.57,3.17 27.3,3.17 26.38,4.1 U$3.P$21
N$7  (1 unrouted)
N$8
  Top 0.305: U$3.P$7 16.58,4.06 18.41,2.22 31.22,2.22 R201.2
N$9  (1 unrouted)
N$10  (3 unrouted)
N$11  (3 unrouted)
N$12  (3 unrouted)
N$13  (2 unrouted)
N$14  (2 unrouted)
N$15  (2 unrouted)
N$16  (3 unrouted)
N$17  (3 unrouted)
N$18  (2 unrouted)
N$19  (3 unrouted)
N$20  (2 unrouted)
N$21  (2 unrouted)
N$22  (3 unrouted)
N$23  (1 unrouted)
N$24  (1 unrouted)
N$25  (3 unrouted)
N$26  (3 unrouted)
N$27  (2 unrouted)
N$28  (2 unrouted)
N$29  (1 unrouted)
N$30  (3 unrouted)
N$31  (3 unrouted)
N$32  (2 unrouted)
N$33  (3 unrouted)
N$34  (2 unrouted)
N$35  (3 unrouted)
N$36  (2 unrouted)
N$37  (3 unrouted)
N$38  (2 unrouted)
N$39  (2 unrouted)
N$40  (2 unrouted)
N$41  (3 unrouted)
N$42  (2 unrouted)
N$43  (2 unrouted)
N$44  (1 unrouted)
N$45  (2 unrouted)
N$46  (2 unrouted)
N$47  (2 unrouted)
N$48  (2 unrouted)
N$49  (2 unrouted)
N$50  (2 unrouted)
N$51  (1 unrouted)
N$52  (2 unrouted)
OLED_CS
  Top 0.305: U$3.P$8 17.28,12.05
OLED_D0/SCK
  Top 0.305: U$3.P$13 20.78,12.05
OLED_D1/MOSI
  Top 0.305: U$3.P$14 21.48,12.05
OLED_D2
  Top 0.305: U$3.P$15 22.18,12.05
OLED_D3
  Top 0.305: U$3.P$16 22.88,12.05
OLED_D4
  Top 0.305: U$3.P$17 23.58,12.05
OLED_D5
  Top 0.305: U$3.P$18 24.28,12.05
OLED_D6
  Top 0.305: U$3.P$19 24.98,12.05
OLED_D7
  Top 0.305: U$3.P$20 25.68,12.05
OLED_DC
  Top 0.305: U$3.P$10 18.68,12.05
OLED_ERD
  Top 0.305: U$3.P$12 20.08,12.05
OLED_RST
  Top 0.305: U$3.P$9 17.98,12.05
OLED_RW
  Top 0.305: U$3.P$11 19.38,12.05
OUTA+  (1 unrouted)
OUTA-  (1 unrouted)
QSPI_CLK  (1 unrouted)
QSPI_D0  (1 unrouted)
QSPI_D1  (1 unrouted)
QSPI_D2  (1 unrouted)
QSPI_D3  (1 unrouted)
QSPI_NCS  (2 unrouted)
RST  (2 unrouted)
SCLK  (1 unrouted)
SDA/CDIN  (1 unrouted)
SDIN  (1 unrouted)
V+  (3 unrouted)
V-  (3 unrouted)
VCOM  (4 unrouted)
VD  (3 unrouted)
VQ1  (3 unrouted)
VREF  (13 unrouted)

### Text on the board
tPlace: +5v | gnd | OLED Adaptor Rev01 | vcc | BS2 | BS1 | BS0